# Altium schematic sheet Växelriktare.SchDoc
size A2; SheetNumber: 1; SheetTotal: 1
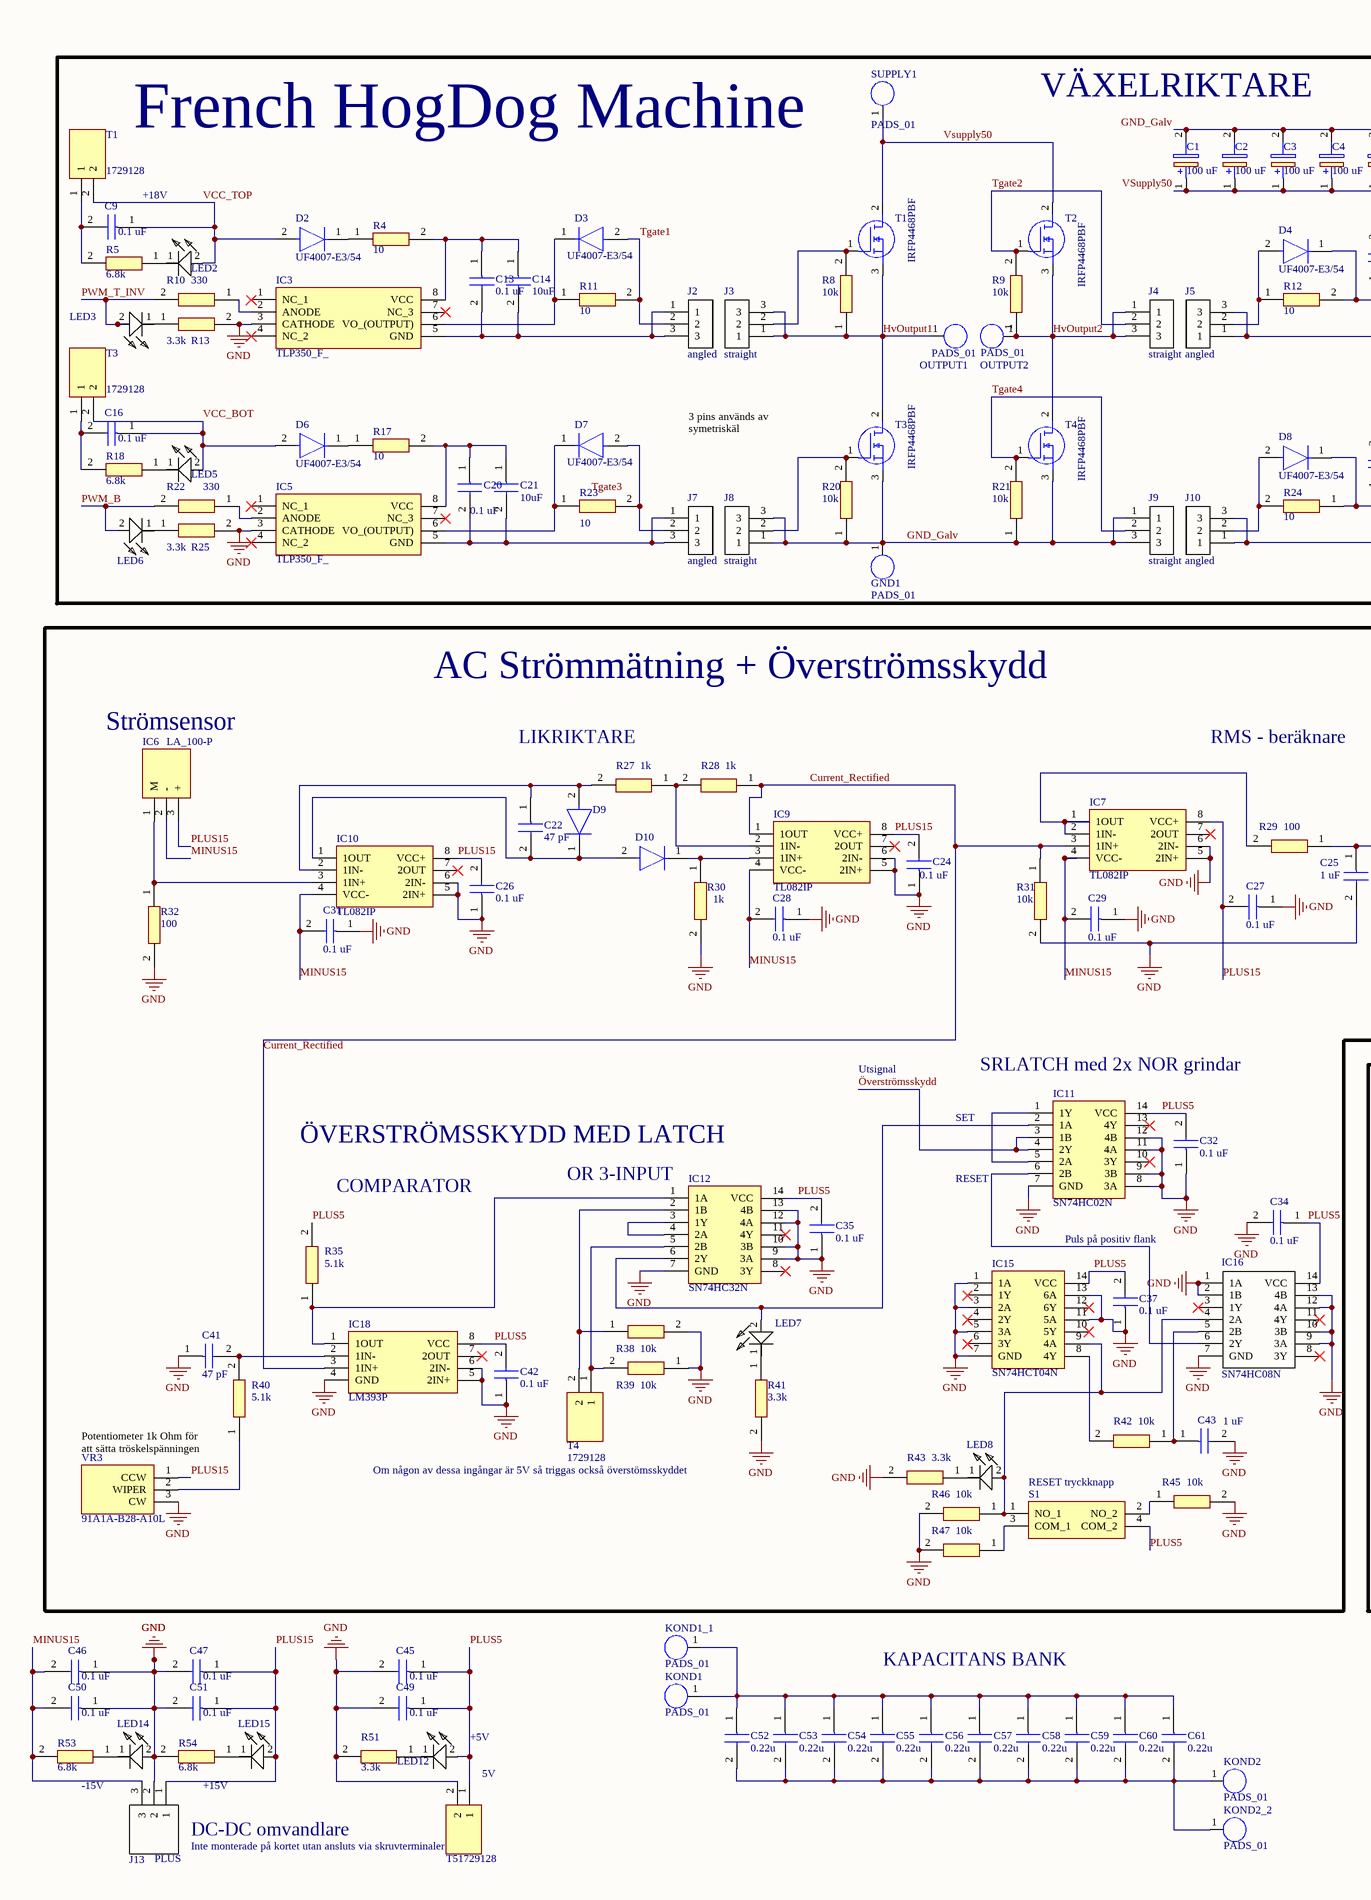
[diagram p0: Växelriktare.SchDoc, left]
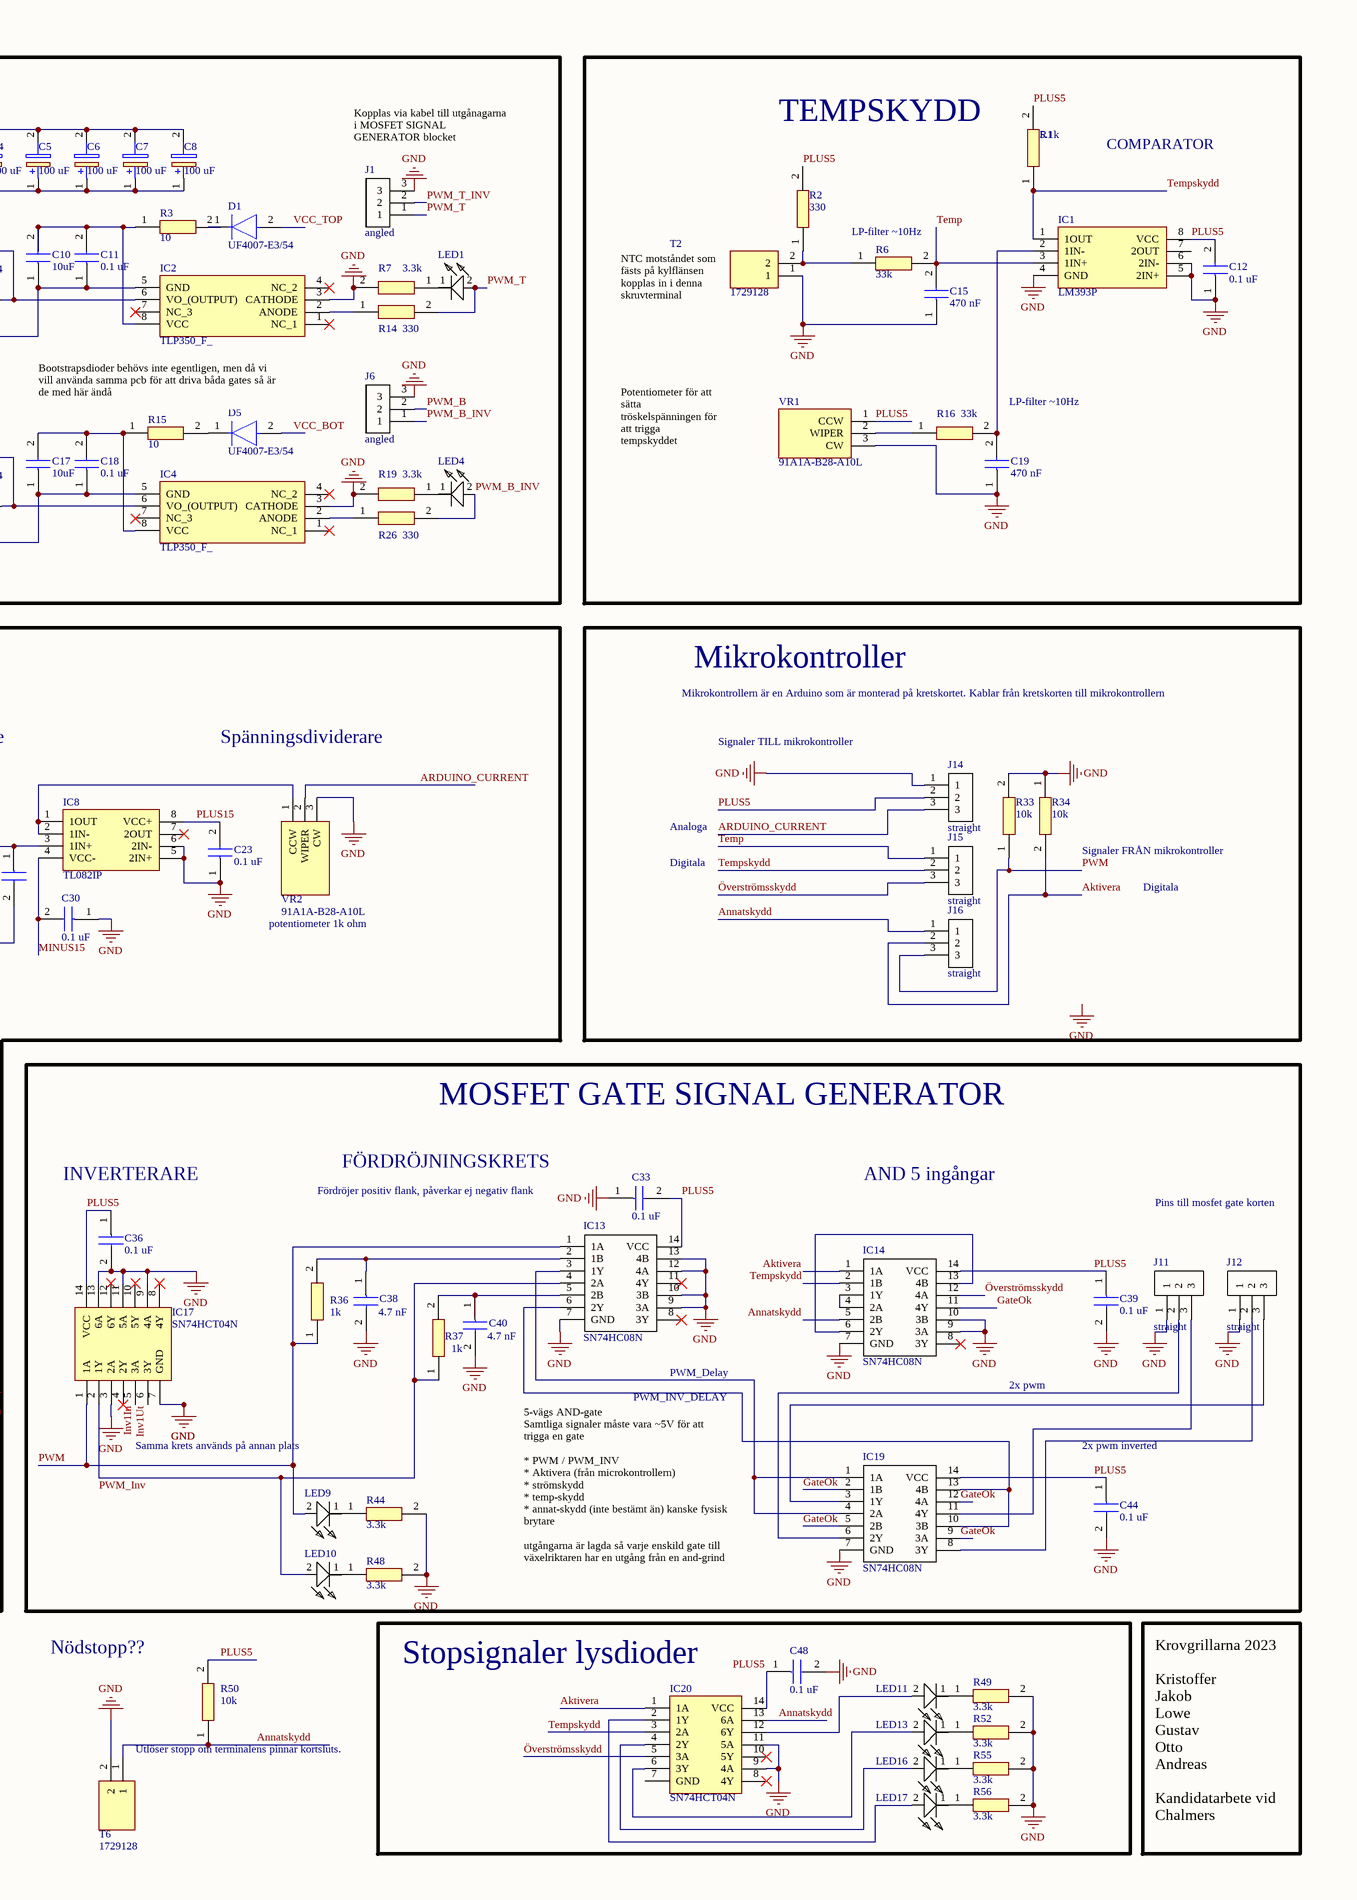
[diagram p1: Växelriktare.SchDoc, right]

## Parts
(Parts that share a designator on the sheet are numbered #1, #2 ... from top to bottom, then left to right.)
C1  100 uF  [CAPPRD500W65D1000H1300]
C2  100 uF  [CAPPRD500W65D1000H1300]
C3  100 uF  [CAPPRD500W65D1000H1300]
C4  100 uF  [CAPPRD500W65D1000H1300]
C5  100 uF  [CAPPRD500W65D1000H1300]
C6  100 uF  [CAPPRD500W65D1000H1300]
C7  100 uF  [CAPPRD500W65D1000H1300]
C8  100 uF  [CAPPRD500W65D1000H1300]
C9  0.1 uF  [R82(7.2X2.5)]
C10  10uF  [1814768]
C11  0.1 uF  [R82(7.2X2.5)]
C12  0.1 uF  [R82(7.2X2.5)]
C13  0.1 uF  [R82(7.2X2.5)]
C14  10uF  [1814768]
C15  470 nF  [C320C334K5R5TA91707301]
C16  0.1 uF  [R82(7.2X2.5)]
C17  10uF  [1814768]
C18  0.1 uF  [R82(7.2X2.5)]
C19  470 nF  [C320C334K5R5TA91707301]
C20  0.1 uF  [R82(7.2X2.5)]
C21  10uF  [1814768]
C22  47 pF  [DE11XRA470KA4BQ01F]
C23  0.1 uF  [R82(7.2X2.5)]
C24  0.1 uF  [R82(7.2X2.5)]
C25  1 uF  [C320C334K5R5TA91707301]
C26  0.1 uF  [R82(7.2X2.5)]
C27  0.1 uF  [R82(7.2X2.5)]
C28  0.1 uF  [R82(7.2X2.5)]
C29  0.1 uF  [R82(7.2X2.5)]
C30  0.1 uF  [R82(7.2X2.5)]
C31  0.1 uF  [R82(7.2X2.5)]
C32  0.1 uF  [R82(7.2X2.5)]
C33  0.1 uF  [R82(7.2X2.5)]
C34  0.1 uF  [R82(7.2X2.5)]
C35  0.1 uF  [R82(7.2X2.5)]
C36  0.1 uF  [R82(7.2X2.5)]
C37  0.1 uF  [R82(7.2X2.5)]
C38  4.7 nF  [C320C334K5R5TA91707301]
C39  0.1 uF  [R82(7.2X2.5)]
C40  4.7 nF  [C320C334K5R5TA91707301]
C41  47 pF  [DE11XRA470KA4BQ01F]
C42  0.1 uF  [R82(7.2X2.5)]
C43  1 uF  [C320C334K5R5TA91707301]
C44  0.1 uF  [R82(7.2X2.5)]
C45  0.1 uF  [R82(7.2X2.5)]
C46  0.1 uF  [R82(7.2X2.5)]
C47  0.1 uF  [R82(7.2X2.5)]
C48  0.1 uF  [R82(7.2X2.5)]
C49  0.1 uF  [R82(7.2X2.5)]
C50  0.1 uF  [R82(7.2X2.5)]
C51  0.1 uF  [R82(7.2X2.5)]
C52  0.22u  [PHE845VY6220MR30L2]
C53  0.22u  [PHE845VY6220MR30L2]
C54  0.22u  [PHE845VY6220MR30L2]
C55  0.22u  [PHE845VY6220MR30L2]
C56  0.22u  [PHE845VY6220MR30L2]
C57  0.22u  [PHE845VY6220MR30L2]
C58  0.22u  [PHE845VY6220MR30L2]
C59  0.22u  [PHE845VY6220MR30L2]
C60  0.22u  [PHE845VY6220MR30L2]
C61  0.22u  [PHE845VY6220MR30L2]
D1  UF4007-E3/54  [FP-UF4007-MFG]
D2  UF4007-E3/54  [FP-UF4007-MFG]
D3  UF4007-E3/54  [FP-UF4007-MFG]
D4  UF4007-E3/54  [FP-UF4007-MFG]
D5  UF4007-E3/54  [FP-UF4007-MFG]
D6  UF4007-E3/54  [FP-UF4007-MFG]
D7  UF4007-E3/54  [FP-UF4007-MFG]
D8  UF4007-E3/54  [FP-UF4007-MFG]
D9  UF4007-E3/54  [FP-UF4007-MFG]  (value not drawn)
D10  UF4007-E3/54  [FP-UF4007-MFG]  (value not drawn)
GND1  PADS_01  [PCBComponent_1]
IC1  LM393P  [DIP794W53P254L959H508Q8N]
IC2  TLP350_F_  [DIP762W60P254L966H485Q8N]
IC3  TLP350_F_  [DIP762W60P254L966H485Q8N]
IC4  TLP350_F_  [DIP762W60P254L966H485Q8N]
IC5  TLP350_F_  [DIP762W60P254L966H485Q8N]
IC6  LA_100-P  [LA-100-P]
IC7  TL082IP  [DIP794W53P254L959H508Q8N]
IC8  TL082IP  [DIP794W53P254L959H508Q8N]
IC9  TL082IP  [DIP794W53P254L959H508Q8N]
IC10  TL082IP  [DIP794W53P254L959H508Q8N]
IC11  SN74HC02N  [DIP794W53P254L1930H508Q14N]
IC12  SN74HC32N  [DIP794W53P254L1930H508Q14N]
IC13  SN74HC08N  [DIP794W53P254L1930H508Q14N]
IC14  SN74HC08N  [DIP794W53P254L1930H508Q14N]
IC15  SN74HCT04N  [DIP794W53P254L1930H508Q14N]
IC16  SN74HC08N  [DIP794W53P254L1930H508Q14N]
IC17  SN74HCT04N  [DIP794W53P254L1930H508Q14N]
IC18  LM393P  [DIP794W53P254L959H508Q8N]
IC19  SN74HC08N  [DIP794W53P254L1930H508Q14N]
IC20  SN74HCT04N  [DIP794W53P254L1930H508Q14N]
J1  angled  [RHDRRA3W79P254_1X3_813X851X241P]
J2  angled  [RHDRRA3W79P254_1X3_813X851X241P]
J3  straight  [HDRV3W67P0X254_1X3_737X236X1117P]
J4  straight  [HDRV3W67P0X254_1X3_737X236X1117P]
J5  angled  [RHDRRA3W79P254_1X3_813X851X241P]
J6  angled  [RHDRRA3W79P254_1X3_813X851X241P]
J7  angled  [RHDRRA3W79P254_1X3_813X851X241P]
J8  straight  [HDRV3W67P0X254_1X3_737X236X1117P]
J9  straight  [HDRV3W67P0X254_1X3_737X236X1117P]
J10  angled  [RHDRRA3W79P254_1X3_813X851X241P]
J11  straight  [HDRV3W67P0X254_1X3_737X236X1117P]
J12  straight  [HDRV3W67P0X254_1X3_737X236X1117P]
J13  PLUS  [1711039]
J14  straight  [HDRV3W67P0X254_1X3_737X236X1117P]
J15  straight  [HDRV3W67P0X254_1X3_737X236X1117P]
J16  straight  [HDRV3W67P0X254_1X3_737X236X1117P]
KOND1  PADS_01  [PCBComponent_1]
KOND1_1  PADS_01  [PCBComponent_1]
KOND2  PADS_01  [PCBComponent_1]
KOND2_2  PADS_01  [PCBComponent_1]
LED1  150141RS73113  [LEDM3528X210N]  (value not drawn)
LED2  150141RS73113  [LEDM3528X210N]  (value not drawn)
LED3  150141RS73113  [LEDM3528X210N]  (value not drawn)
LED4  150141RS73113  [LEDM3528X210N]  (value not drawn)
LED5  150141RS73113  [LEDM3528X210N]  (value not drawn)
LED6  150141RS73113  [LEDM3528X210N]  (value not drawn)
LED7  150141RS73113  [LEDM3528X210N]  (value not drawn)
LED8  150141RS73113  [LEDM3528X210N]  (value not drawn)
LED9  150141RS73113  [LEDM3528X210N]  (value not drawn)
LED10  150141RS73113  [LEDM3528X210N]  (value not drawn)
LED11  150141RS73113  [LEDM3528X210N]  (value not drawn)
LED12  150141RS73113  [LEDM3528X210N]  (value not drawn)
LED13  150141RS73113  [LEDM3528X210N]  (value not drawn)
LED14  150141RS73113  [LEDM3528X210N]  (value not drawn)
LED15  150141RS73113  [LEDM3528X210N]  (value not drawn)
LED16  150141RS73113  [LEDM3528X210N]  (value not drawn)
LED17  150141RS73113  [LEDM3528X210N]  (value not drawn)
OUTPUT1  PADS_01  [PCBComponent_1]
OUTPUT2  PADS_01  [PCBComponent_1]
R1  5.1k  [RESAD2760W83L1200D390]
R2  330  [RESAD2760W83L1200D390]
R3  10  [RESAD2760W83L1200D390]
R4  10  [RESAD2760W83L1200D390]
R5  6.8k  [RESAD2760W83L1200D390]
R6  33k  [RESAD2760W83L1200D390]
R7  3.3k  [RESAD2760W83L1200D390]
R8  10k  [RESAD2760W83L1200D390]
R9  10k  [RESAD2760W83L1200D390]
R10  330  [RESAD2760W83L1200D390]
R11  10  [RESAD2760W83L1200D390]
R12  10  [RESAD2760W83L1200D390]
R13  3.3k  [RESAD2760W83L1200D390]
R14  330  [RESAD2760W83L1200D390]
R15  10  [RESAD2760W83L1200D390]
R16  33k  [RESAD2760W83L1200D390]
R17  10  [RESAD2760W83L1200D390]
R18  6.8k  [RESAD2760W83L1200D390]
R19  3.3k  [RESAD2760W83L1200D390]
R20  10k  [RESAD2760W83L1200D390]
R21  10k  [RESAD2760W83L1200D390]
R22  330  [RESAD2760W83L1200D390]
R23  10  [RESAD2760W83L1200D390]
R24  10  [RESAD2760W83L1200D390]
R25  3.3k  [RESAD2760W83L1200D390]
R26  330  [RESAD2760W83L1200D390]
R27  1k  [RESAD2760W83L1200D390]
R28  1k  [RESAD2760W83L1200D390]
R29  100  [RESAD2760W83L1200D390]
R30  1k  [RESAD2760W83L1200D390]
R31  10k  [RESAD2760W83L1200D390]
R32  100  [RESAD2760W83L1200D390]
R33  10k  [RESAD2760W83L1200D390]
R34  10k  [RESAD2760W83L1200D390]
R35  5.1k  [RESAD2760W83L1200D390]
R36  1k  [RESAD2760W83L1200D390]
R37  1k  [RESAD2760W83L1200D390]
R38  10k  [RESAD2760W83L1200D390]
R39  10k  [RESAD2760W83L1200D390]
R40  5.1k  [RESAD2760W83L1200D390]
R41  3.3k  [RESAD2760W83L1200D390]
R42  10k  [RESAD2760W83L1200D390]
R43  3.3k  [RESAD2760W83L1200D390]
R44  3.3k  [RESAD2760W83L1200D390]
R45  10k  [RESAD2760W83L1200D390]
R46  10k  [RESAD2760W83L1200D390]
R47  10k  [RESAD2760W83L1200D390]
R48  3.3k  [RESAD2760W83L1200D390]
R49  3.3k  [RESAD2760W83L1200D390]
R50  10k  [RESAD2760W83L1200D390]
R51  3.3k  [RESAD2760W83L1200D390]
R52  3.3k  [RESAD2760W83L1200D390]
R53  6.8k  [RESAD2760W83L1200D390]
R54  6.8k  [RESAD2760W83L1200D390]
R55  3.3k  [RESAD2760W83L1200D390]
R56  3.3k  [RESAD2760W83L1200D390]
S1  PTS645SM43-2_LFS  [PTS645SM432LFS]  (value not drawn)
SUPPLY1  PADS_01  [PCBComponent_1]
T1#1  1729128  [1729128]
T1#2  IRFP4468PBF  [TO546P531X1558X2499-3P]
T2#1  IRFP4468PBF  [TO546P531X1558X2499-3P]
T2#2  1729128  [1729128]
T3#1  1729128  [1729128]
T3#2  IRFP4468PBF  [TO546P531X1558X2499-3P]
T4#1  IRFP4468PBF  [TO546P531X1558X2499-3P]
T4#2  1729128  [1729128]
T5  1729128  [1729128]
T6  1729128  [1729128]
VR1  91A1A-B28-A10L  [91A1AB28A10L]
VR2  91A1A-B28-A10L  [91A1AB28A10L]
VR3  91A1A-B28-A10L  [91A1AB28A10L]

## Blocks framed on the sheet
French HogDog Machine: C1-C11 C13 C14 C16-C18 C20 C21 D1-D8 GND1 IC2-IC5 J1-J10 LED1-LED6 OUTPUT1 OUTPUT2 R3-R5 R7-R15 R17-R26 SUPPLY1 T1#1 T1#2 T2#1 T3#1 T3#2 T4#1
TEMPSKYDD: C12 C15 C19 IC1 R1 R2 R6 R16 T2#2 VR1
AC Strömmätning + Överströmsskydd: C22-C32 C34 C35 C37 C41-C43 D9 D10 IC6-IC12 IC15 IC16 IC18 LED7 LED8 R27-R32 R35 R38-R43 R45-R47 S1 T4#2 VR2 VR3
Mikrokontroller: J14-J16 R33 R34
MOSFET GATE SIGNAL GENERATOR: C33 C36 C38-C40 C44 IC13 IC14 IC17 IC19 J11 J12 LED9 LED10 R36 R37 R44 R48
Stopsignaler lysdioder: C48 IC20 LED11 LED13 LED16 LED17 R49 R52 R55 R56

## Nets
GND: C12.1 C15.1 C19.1 C23.1 C24.1 C25.2 C26.1 C27.1 C28.1 C29.1 C30.1 C31.1 C32.1 C33.1 C34.2 C35.1 C36.2 C37.1 C38.2 C39.2 C40.2 C41.1 C42.1 C43.2 C44.2 C45.2 C46.1 C47.2 C48.2 C49.2 C50.1 C51.2 IC1.4(GND) IC1.5(2IN+) IC1.6(2IN-) IC2.3(CATHODE) IC3.3(CATHODE) IC4.3(CATHODE) IC5.3(CATHODE) IC7.5(2IN+) IC7.6(2IN-) IC8.5(2IN+) IC8.6(2IN-) IC9.5(2IN+) IC9.6(2IN-) IC10.5(2IN+) IC10.6(2IN-) IC11.7(GND) IC11.8(3A) IC11.9(3B) IC11.11(4A) IC11.12(4B) IC12.7(GND) IC12.9(3A) IC12.10(3B) IC12.12(4A) IC12.13(4B) IC13.7(GND) IC13.9(3A) IC13.10(3B) IC13.12(4A) IC13.13(4B) IC14.7(GND) IC14.9(3A) IC14.10(3B) IC15.1(1A) IC15.3(2A) IC15.5(3A) IC15.7(GND) IC15.11(5A) IC15.13(6A) IC16.1(1A) IC16.2(1B) IC16.7(GND) IC16.9(3A) IC16.10(3B) IC16.12(4A) IC16.13(4B) IC17.3(2A) IC17.7(GND) IC17.9(4A) IC17.11(5A) IC17.13(6A) IC18.4(GND) IC18.5(2IN+) IC18.6(2IN-) IC19.7(GND) IC20.9(4A) IC20.11(5A) J1.3 J6.3 J11.1 J12.1 J13.2 J14.1 LED14.2(A) R7.2 R13.2 R19.2 R25.2 R30.2 R31.2 R32.2 R33.2 R34.1 R38.2 R39.1 R41.2 R43.2 R44.2 R45.2 R46.2 R47.2 R48.2 R49.2 R51.2 R52.2 R54.2 R55.2 R56.2 T2#2.1 T5.2 T6.2 VR1.3(CW) VR2.3(CW) VR3.3(CW)
Aktivera: IC14.1(1A) IC20.1(1A) J16.2 R34.2
Annatskydd: IC14.5(2B) IC20.13(6A) J16.1 R50.1 T6.1
ARDUINO_CURRENT: J14.3 VR2.2(WIPER)
Current_Rectified: IC7.3(1IN+) IC9.1(1OUT) IC18.3(1IN+) R28.1 R31.1
GateOk: IC14.11(4Y) IC19.2(1B) IC19.5(2B) IC19.9(3A) IC19.12(4A)
GND_Galv: C1.2(-) C2.2(-) C3.2(-) C4.2(-) C5.2(-) C6.2(-) C7.2(-) C8.2(-) GND1.1 J8.1 J8.3 J9.1 J9.3 R20.1 R21.1 T3#2.3(S) T4#1.3(S)
HvOutput1: J3.1 J3.3 OUTPUT1.1 R8.1 T1#2.3(S) T3#2.2(D)
HvOutput2: J4.1 J4.3 OUTPUT2.1 R9.1 T2#1.3(S) T4#1.2(D)
Inv1In: IC17.5(3A)
Inv1Ut: IC17.6(3Y)
MINUS15: C28.2 C29.2 C30.2 C31.2 C46.2 C50.2 IC6.2(-) IC7.4(VCC-) IC8.4(VCC-) IC9.4(VCC-) IC10.4(VCC-) J13.3 R53.2
PLUS5: C12.2 C32.2 C33.2 C34.1 C35.2 C36.1 C37.2 C39.1 C42.2 C44.1 C45.1 C48.1 C49.1 IC1.8(VCC) IC11.14(VCC) IC12.14(VCC) IC13.14(VCC) IC14.14(VCC) IC15.14(VCC) IC16.14(VCC) IC17.14(VCC) IC18.8(VCC) IC19.14(VCC) IC20.14(VCC) J14.2 LED12.2(A) R1.2 R2.2 R35.2 R50.2 S1.4(COM_2) T5.1 VR1.1(CCW)
PLUS15: C23.2 C24.2 C26.2 C27.2 C47.1 C51.1 IC6.3(+) IC7.8(VCC+) IC8.8(VCC+) IC9.8(VCC+) IC10.8(VCC+) J13.1 LED15.2(A) VR3.1(CCW)
PWM: IC13.1(1A) IC17.1(1A) J16.3 LED9.2(A) R33.1 R36.1
PWM_B: J6.2 LED6.2(A) R22.2
PWM_B_INV: J6.1 LED4.2(A) R26.2
PWM_Inv: IC13.4(2A) IC17.2(1Y) LED10.2(A) R37.1
PWM_T: J1.1 LED1.2(A) R14.2
PWM_T_INV: J1.2 LED3.2(A) R10.2
Temp: C15.2 IC1.3(1IN+) J15.1 R6.2
Tempskydd: IC1.1(1OUT) IC14.2(1B) IC20.3(2A) J15.2 R1.1
Tgate1: D3.2(A) J2.2 R11.2
Tgate2: J4.2 R9.2 T2#1.1(G)
Tgate4: J9.2 R21.2 T4#1.1(G)
VCC_BOT: C16.1 D5.2(A) D6.2(A) LED5.2(A) T3#1.2
VCC_TOP: C9.1 D1.2(A) D2.2(A) LED2.2(A) T1#1.2
Vsupply50: C1.1(+) C2.1(+) C3.1(+) C4.1(+) C5.1(+) C6.1(+) C7.1(+) C8.1(+) SUPPLY1.1 T1#2.2(D) T2#1.2(D)
Överströmsskydd: IC11.3(1B) IC11.4(2Y) IC14.12(4A) IC20.5(3A) J15.3
NetC9_2: C9.2 R5.2 T1#1.1
NetC10_1: C10.1(+) C11.1 IC2.5(GND) J5.1 J5.3
NetC10_2: C10.2(-) C11.2 IC2.8(VCC) R3.1
NetC13_1: C13.1 C14.1(+) IC3.8(VCC) R4.2
NetC13_2: C13.2 C14.2(-) IC3.5(GND) J2.1 J2.3
NetC16_2: C16.2 R18.2 T3#1.1
NetC17_1: C17.1(+) C18.1 IC4.5(GND) J10.1 J10.3
NetC17_2: C17.2(-) C18.2 IC4.8(VCC) R15.1
NetC19_2: C19.2 IC1.2(1IN-) R16.2
NetC20_1: C20.1 C21.1(+) IC5.8(VCC) R17.2
NetC20_2: C20.2 C21.2(-) IC5.5(GND) J7.1 J7.3
NetC22_1: C22.1 D9.2(A) IC10.2(1IN-) R27.2
NetC22_2: C22.2 D9.1(C) D10.2(A) IC10.1(1OUT)
NetC25_1: C25.1 IC8.3(1IN+) R29.1
NetC38_1: C38.1 IC13.2(1B) R36.2
NetC40_1: C40.1 IC13.5(2B) R37.2
NetC41_2: C41.2 IC18.2(1IN-) R40.2
NetC43_1: C43.1 IC16.5(2B) R42.1
NetC52_1: C52.1 C53.1 C54.1 C55.1 C56.1 C57.1 C58.1 C59.1 C60.1 C61.1 KOND1.1 KOND1_1.1
NetC52_2: C52.2 C53.2 C54.2 C55.2 C56.2 C57.2 C58.2 C59.2 C60.2 C61.2 KOND2.1 KOND2_2.1
NetD1_1: D1.1(C) R3.2
NetD2_1: D2.1(C) R4.1
NetD3_1: D3.1(C) IC3.6(VO_(OUTPUT)) R11.1
NetD4_1: D4.1(C) IC2.6(VO_(OUTPUT)) R12.2
NetD4_2: D4.2(A) J5.2 R12.1
NetD5_1: D5.1(C) R15.2
NetD6_1: D6.1(C) R17.1
NetD7_1: D7.1(C) IC5.6(VO_(OUTPUT)) R23.1
NetD7_2: D7.2(A) J7.2 R23.2
NetD8_1: D8.1(C) IC4.6(VO_(OUTPUT)) R24.1
NetD8_2: D8.2(A) J10.2 R24.2
NetD10_1: D10.1(C) IC9.3(1IN+) R30.1
NetIC2_2: IC2.2(ANODE) R14.1
NetIC3_2: IC3.2(ANODE) R10.1
NetIC4_2: IC4.2(ANODE) R26.1
NetIC5_2: IC5.2(ANODE) R22.1
NetIC6_1: IC6.1(M) IC10.3(1IN+) R32.1
NetIC7_1: IC7.1(1OUT) IC7.2(1IN-) R29.2
NetIC8_1: IC8.1(1OUT) IC8.2(1IN-) VR2.1(CCW)
NetIC9_2: IC9.2(1IN-) R27.1 R28.2
NetIC11_1: IC11.1(1Y) IC11.5(2A)
NetIC11_2: IC11.2(1A) IC12.6(2Y) LED7.2(A)
NetIC11_6: IC11.6(2B) IC16.6(2Y)
NetIC12_1: IC12.1(1A) IC18.1(1OUT) R35.1
NetIC12_2: IC12.2(1B) R38.1 T4#2.2
NetIC12_3: IC12.3(1Y) IC12.4(2A)
NetIC12_5: IC12.5(2B) R39.2 T4#2.1
NetIC13_3: IC13.3(1Y) IC19.1(1A) IC19.4(2A)
NetIC13_6: IC13.6(2Y) IC19.10(3B) IC19.13(4B)
NetIC14_3: IC14.3(1Y) IC14.4(2A)
NetIC14_6: IC14.6(2Y) IC14.13(4B)
NetIC15_8: IC15.8(4Y) R42.2
NetIC15_9: IC15.9(4A) IC16.4(2A) LED8.2(A) R46.1 S1.1(NO_1)
NetIC19_3: IC19.3(1Y) J12.3
NetIC19_6: IC19.6(2Y) J11.2
NetIC19_8: IC19.8(3Y) J12.2
NetIC19_11: IC19.11(4Y) J11.3
NetIC20_2: IC20.2(1Y) LED17.2(A)
NetIC20_4: IC20.4(2Y) LED16.2(A)
NetIC20_6: IC20.6(3Y) LED13.2(A)
NetIC20_12: IC20.12(6Y) LED11.2(A)
NetJ3_2: J3.2 R8.2 T1#2.1(G)
NetJ8_2: J8.2 R20.2 T3#2.1(G)
NetLED1_1: LED1.1(K) R7.1
NetLED2_1: LED2.1(K) R5.1
NetLED3_1: LED3.1(K) R13.1
NetLED4_1: LED4.1(K) R19.1
NetLED5_1: LED5.1(K) R18.1
NetLED6_1: LED6.1(K) R25.1
NetLED7_1: LED7.1(K) R41.1
NetLED8_1: LED8.1(K) R43.1
NetLED9_1: LED9.1(K) R44.1
NetLED10_1: LED10.1(K) R48.1
NetLED11_1: LED11.1(K) R49.1
NetLED12_1: LED12.1(K) R51.1
NetLED13_1: LED13.1(K) R52.1
NetLED14_1: LED14.1(K) R53.1
NetLED15_1: LED15.1(K) R54.1
NetLED16_1: LED16.1(K) R55.1
NetLED17_1: LED17.1(K) R56.1
NetR2_1: R2.1 R6.1 T2#2.2
NetR16_1: R16.1 VR1.2(WIPER)
NetR40_1: R40.1 VR3.2(WIPER)
NetR45_1: R45.1 S1.2(NO_2)
NetR47_1: R47.1 S1.3(COM_1)

Not connected (* = marked no-connect by the designer): IC1 7(2OUT); IC2 1(NC_1)* 4(NC_2)* 7(NC_3)*; IC3 1(NC_1)* 4(NC_2)* 7(NC_3)*; IC4 1(NC_1)* 4(NC_2)* 7(NC_3)*; IC5 1(NC_1)* 4(NC_2)* 7(NC_3)*; IC7 7(2OUT)*; IC8 7(2OUT)*; IC9 7(2OUT)*; IC10 7(2OUT)*; IC11 10(3Y)* 13(4Y)*; IC12 8(3Y)* 11(4Y)*; IC13 8(3Y)* 11(4Y)*; IC14 8(3Y)*; IC15 2(1Y)* 4(2Y)* 6(3Y)* 10(5Y)* 12(6Y)*; IC16 3(1Y)* 8(3Y)* 11(4Y)*; IC17 4(2Y)* 8(4Y)* 10(5Y)* 12(6Y)*; IC18 7(2OUT)*; IC20 7(GND) 8(4Y)* 10(5Y)*

## Notes on the sheet
- VÄXELRIKTARE
- Kopplas via kabel till utgånagarna i MOSFET SIGNAL GENERATOR blocket
- COMPARATOR
- +18V
- (near R6) LP-filter ~10Hz
- NTC motståndet som fästs på kylflänsen kopplas in i denna skruvterminal
- Bootstrapsdioder behövs inte egentligen, men då vi vill använda samma pcb för att driva båda gates så är de med här ändå
- LP-filter ~10Hz
- 3 pins används av symetriskäl
- Potentiometer för att sätta tröskelspänningen för att trigga tempskyddet
- Mikrokontrollern är en Arduino som är monterad på kretskortet. Kablar från kretskorten till mikrokontrollern
- Strömsensor
- (near R27) LIKRIKTARE
- RMS - beräknare
- Spänningsdividerare
- Signaler TILL mikrokontroller
- Analoga
- Digitala
- (near R34) Signaler FRÅN mikrokontroller
- potentiometer 1k ohm
- Utsignal
- (near IC11) SRLATCH med 2x NOR grindar
- SET
- ÖVERSTRÖMSSKYDD MED LATCH
- (near IC12) OR 3-INPUT
- RESET
- INVERTERARE
- Fördröjer positiv flank, påverkar ej negativ flank
- FÖRDRÖJNINGSKRETS
- AND 5 ingångar
- Puls på positiv flank
- Pins till mosfet gate korten
- PWM_Delay
- PWM_INV_DELAY
- 2x pwm
- Potentiometer 1k Ohm för att sätta tröskelspänningen
- Om någon av dessa ingångar är 5V så triggas också överstömsskyddet
- RESET tryckknapp
- Samma krets används på annan plats
- 2x pwm inverted
- 5-vägs AND-gate
  Samtliga signaler måste vara ~5V för att trigga en gate
  * PWM / PWM_INV
  * Aktivera (från microkontrollern)
  * strömskydd
  * temp-skydd
  * annat-skydd (inte bestämt än) kanske fysisk brytare
  utgångarna är lagda så varje enskild gate till växelriktaren har en utgång från en and-grind
- KAPACITANS BANK
- Nödstopp??
- (near LED12) +5V
- -15V
- +15V
- 5V
- Utlöser stopp om terminalens pinnar kortsluts.
- (near J13) DC-DC omvandlare
- Inte monterade på kortet utan ansluts via skruvterminaler
- Krovgrillarna 2023
  Kristoffer
  Jakob
  Lowe
  Gustav
  Otto
  Andreas
  Kandidatarbete vid Chalmers
- Labels drawn without touching a wire or pin: GND, Tgate3

## Library data of the parts
C1-C8 = 63SXE100M: Capacitor Polarised; Manufacturer_Name: Panasonic; Datasheet Link: http://industrial.panasonic.com/cdbs/www-data/pdf/AAB8000/AAB8000C262.pdf; Height: 13mm; Manufacturer_Part_Number: 63SXE100M; Mouser Part Number: 667-63SXE100M; Mouser Price/Stock: https://www.mouser.co.uk/ProductDetail/Panasonic/63SXE100M?qs=%252B6g0mu59x7Ltzd4977WBfg%3D%3D
C9 C11-C13 C15 C16 C18-C20 C23-C40 C42-C51 = C320C334K5R5TA91707301: Capacitor; Manufacturer_Name: KEMET; Datasheet Link: https://content.kemet.com/datasheets/KEM_C1053_GOLDMAX_X7R_AUTO.pdf; Manufacturer_Part_Number: C320C334K5R5TA91707301; Mouser Part Number: 80-C320C334K5R9170-R; Mouser Price/Stock: https://www.mouser.co.uk/ProductDetail/KEMET/C320C334K5R5TA91707301?qs=CMe0l2alOJWOav3f3bfBiQ%3D%3D
C10 C14 C17 C21 = 181-4768: Capacitor; Manufacturer_Name: RS Components; Datasheet Link: https://docs.rs-online.com/821c/0900766b816c111a.pdf; Height: 13mm; Manufacturer_Part_Number: 181-4768
C22 C41 = DE11XRA470KA4BQ01F: Capacitor; Manufacturer_Name: Murata Electronics; Datasheet Link: https://www.mouser.com/datasheet/2/281/DE1_RA_Q01F_E-1115434.pdf; Height: 11mm; Manufacturer_Part_Number: DE11XRA470KA4BQ01F; Mouser Part Number: 81-DE11XRA470KA4BQ1F; Mouser Price/Stock: https://www.mouser.co.uk/ProductDetail/Murata-Electronics/DE11XRA470KA4BQ01F?qs=5aG0NVq1C4zq%2FuZurxxCqg%3D%3D; Arrow Part Number: DE11XRA470KA4BQ01F; Arrow Price/Stock: https://www.arrow.com/en/products/de11xra470ka4bq01f/murata-manufacturing
C52-C61 = PHE845VY6220MR30L2: Capacitor; Manufacturer_Name: KEMET; Datasheet Link: https://connect.kemet.com:7667/gateway/IntelliData-ComponentDocumentation/1.0/download/specsheet/F845DY224M760ALW0L; Height: 24.5mm; Manufacturer_Part_Number: PHE845VY6220MR30L2; Mouser Part Number: 80-PHE845VY6220MR30; Mouser Price/Stock: https://www.mouser.co.uk/ProductDetail/KEMET/PHE845VY6220MR30L2?qs=MdJgNetHbfmnkWE77glUFA%3D%3D
D1-D10 = CMP-02540-000043-1: DIODE GEN PURP 1KV 1A DO204AL; Manufacturer: Vishay; Max Junction Temp: +150°C; Max Repetitive Reverse Voltage: 1000V; Max Surge Forward Current: 30A; Capacitance: 17pF; Peak Reverse Current: 10uA; Value: 17pF; Package: UF4007; Height: 2.7mm; RoHS: TRUE; Device Class L3: Rectifier Diodes; Temperature Range Low: -55°C; Ipc Land Pattern Name: DIOPA1088W105L520D270; Temperature: -55°C to +150°C; Category: Diode; Device Class L2: Diodes; Device Class L1: Discrete Semiconductors; Digikey Description: DIODE GEN PURP 1KV 1A DO204AL; Octopart: https://octopart.com/uf4007-e3%2F54-vishay-42333894; Mouser Description: Rectifiers Vr/1000V Io/1A; ComponentLink2URL: http://www.vishay.com/docs/88755/uf4001.pdf; Lead Free: Yes; Temperature Range High: +150°C; Automotive: No; Manufacturer Part Number: UF4007-E3/54; ComponentLink2Description: Datasheet; Forward Current: 1A
GND1 KOND1 KOND1_1 KOND2 KOND2_2 OUTPUT1 OUTPUT2 SUPPLY1 = PADS_01: Pads for bigger Coil and capacitors outside your circuit
IC1 IC18 = LM393P: Integrated Circuit; Manufacturer_Name: Texas Instruments; Datasheet Link: http://www.ti.com/lit/ds/symlink/lm393.pdf; Height: 5.08mm; Manufacturer_Part_Number: LM393P; Mouser Part Number: 595-LM393P; Mouser Price/Stock: https://www.mouser.co.uk/ProductDetail/Texas-Instruments/LM393P?qs=1K8%2FAQHn5WT5g4otW1rg%2Fg%3D%3D; Arrow Part Number: LM393P; Arrow Price/Stock: https://www.arrow.com/en/products/lm393p/texas-instruments?region=nac
IC2-IC5 = TLP350_F_: Integrated Circuit; Manufacturer_Name: Toshiba; Manufacturer_Part_Number: TLP350(F); Datasheet Link: https://toshiba.semicon-storage.com/info/docget.jsp?did=6217&prodName=TLP350; Height: 4.85mm; Mouser Part Number: 757-TLP350(F); Mouser Price/Stock: https://www.mouser.co.uk/ProductDetail/Toshiba/TLP350F?qs=f0GatGUIxV2gwSZ6twItgg%3D%3D
IC6 = LA_100-P: Current Sensor; Manufacturer_Name: LEM; Manufacturer_Part_Number: LA 100-P; Datasheet Link: https://datasheet.datasheetarchive.com/originals/distributors/Datasheets-16/DSA-314838.pdf
IC7-IC10 = TL082IP: Integrated Circuit; Manufacturer_Name: Texas Instruments; Datasheet Link: http://www.ti.com/lit/ds/symlink/tl081a.pdf; Height: 5.08mm; Manufacturer_Part_Number: TL082IP; Mouser Part Number: 595-TL082IP; Mouser Price/Stock: https://www.mouser.com/Search/Refine.aspx?Keyword=595-TL082IP; Arrow Part Number: TL082IP; Arrow Price/Stock: https://www.arrow.com/en/products/tl082ip/texas-instruments
IC11 = SN74HC02N: Integrated Circuit; Manufacturer_Name: Texas Instruments; Datasheet Link: https://datasheet.datasheetarchive.com/originals/distributors/SFDatasheet-6/sf-000133830.pdf; Height: 5.08mm; Manufacturer_Part_Number: SN74HC02N; Mouser Part Number: 595-SN74HC02N; Mouser Price/Stock: https://www.mouser.co.uk/ProductDetail/Texas-Instruments/SN74HC02N?qs=st7IWvlL5%2FjbIdufZ10xyA%3D%3D; Arrow Part Number: SN74HC02N; Arrow Price/Stock: https://www.arrow.com/en/products/sn74hc02n/texas-instruments?region=nac
IC12 = SN74HC32N: Integrated Circuit; Manufacturer_Name: Texas Instruments; Datasheet Link: http://www.ti.com/lit/gpn/sn74hc32; Height: 5.08mm; Manufacturer_Part_Number: SN74HC32N; Mouser Part Number: 595-SN74HC32N; Mouser Price/Stock: https://www.mouser.co.uk/ProductDetail/Texas-Instruments/SN74HC32N?qs=tJ5HNKWh3OWs99bm2e8RtQ%3D%3D; Arrow Part Number: SN74HC32N; Arrow Price/Stock: https://www.arrow.com/en/products/sn74hc32n/texas-instruments
IC13 IC14 IC16 IC19 = SN74HC08N: Integrated Circuit; Manufacturer_Name: Texas Instruments; Datasheet Link: http://componentsearchengine.com/Datasheets/1/SN74HC08N.pdf; Height: 5.08mm; Manufacturer_Part_Number: SN74HC08N; Mouser Part Number: 595-SN74HC08N; Mouser Price/Stock: https://www.mouser.co.uk/ProductDetail/Texas-Instruments/SN74HC08N?qs=UGVLDq%2F29uh3etwCLMoeTA%3D%3D; Arrow Part Number: SN74HC08N; Arrow Price/Stock: https://www.arrow.com/en/products/sn74hc08n/texas-instruments?region=nac
IC15 IC17 IC20 = SN74HCT04N: Integrated Circuit; Manufacturer_Name: Texas Instruments; Datasheet Link: http://www.ti.com/lit/gpn/sn74hct04; Height: 5.08mm; Manufacturer_Part_Number: SN74HCT04N; Mouser Part Number: 595-SN74HCT04N; Mouser Price/Stock: https://www.mouser.co.uk/ProductDetail/Texas-Instruments/SN74HCT04N?qs=dQtLEVC3WoYXjRsBQqZvgw%3D%3D; Arrow Part Number: SN74HCT04N; Arrow Price/Stock: https://www.arrow.com/en/products/sn74hct04n/texas-instruments?region=nac
J1 J2 J5-J7 J10 = SSW-103-02-G-S-RA-LL: Connector; Manufacturer_Name: SAMTEC; Datasheet Link: http://suddendocs.samtec.com/catalog_english/ssw_th.pdf; Height: 2.41mm; Manufacturer_Part_Number: SSW-103-02-G-S-RA-LL; Mouser Part Number: 200-SSW10302GSRALL; Mouser Price/Stock: https://www.mouser.co.uk/ProductDetail/Samtec/SSW-103-02-G-S-RA-LL?qs=lDMevKbHVyti%252BcbLX5U9iA%3D%3D
J3 J4 J8 J9 J11 J12 J14-J16 = 22-03-2031: Connector; Manufacturer_Name: Molex; Datasheet Link: http://www.molex.com/pdm_docs/sd/022032031_sd.pdf; Height: 11.17mm; Manufacturer_Part_Number: 22-03-2031; Mouser Part Number: 538-22-03-2031; Mouser Price/Stock: https://www.mouser.co.uk/ProductDetail/Molex/22-03-2031?qs=ILqg114nvd5V8pMNdVJtPA%3D%3D
J13 = 1711039: Connector; Manufacturer_Name: Phoenix Contact; Datasheet Link: http://www.phoenixcontact.com/de/produkte/1711039/pdf; Height: 18.2mm; Manufacturer_Part_Number: 1711039; Mouser Part Number: 651-1711039; Mouser Price/Stock: https://www.mouser.co.uk/ProductDetail/Phoenix-Contact/1711039?qs=YbgdthCBnKeEUIePCOJ5Kg%3D%3D; Arrow Part Number: 1711039; Arrow Price/Stock: https://www.arrow.com/en/products/1711039/phoenix-contact?region=nac
LED1-LED17 = 150141RS73113: LED; Manufacturer_Name: Wurth Elektronik; Datasheet Link: https://katalog.we-online.de/led/datasheet/150141RS73113.pdf; Height: 2.1mm; Manufacturer_Part_Number: 150141RS73113; Mouser Part Number: 710-150141RS73113; Mouser Price/Stock: https://www.mouser.co.uk/ProductDetail/Wurth-Elektronik/150141RS73113?qs=u16ybLDytRaJkUgH%252BpeDTw%3D%3D
R1-R56 = PR02000201009JR500: Resistor; Manufacturer_Name: Vishay; Datasheet Link: https://componentsearchengine.com/Datasheets/2/PR02000201009JR500.pdf; Manufacturer_Part_Number: PR02000201009JR500; Mouser Part Number: 594-5083NW10R00J; Mouser Price/Stock: https://www.mouser.co.uk/ProductDetail/Vishay-BC-Components/PR02000201009JR500?qs=7reVrgTiN3YqjE9KUsFQcQ%3D%3D; Arrow Part Number: PR02000201009JR500; Arrow Price/Stock: https://www.arrow.com/en/products/pr02000201009jr500/vishay?region=nac
S1 = PTS645SM43-2_LFS: Switch; Manufacturer_Name: C & K COMPONENTS; Manufacturer_Part_Number: PTS645SM43-2 LFS; Datasheet Link: https://www.tme.com/Document/8b519d7a65df20ea1a483c3db2ec3948/pts645-DTE.pdf; Height: 4.4mm; Mouser Part Number: 611-PTS645SM432; Mouser Price/Stock: https://www.mouser.com/Search/Refine.aspx?Keyword=611-PTS645SM432; Arrow Part Number: PTS645SM43-2 LFS; Arrow Price/Stock: https://www.arrow.com/en/products/pts645sm432lfs/ck?region=nac
T1#1 T2#2 T3#1 T4#2 T5 T6 = 1729128: Connector; Manufacturer_Name: Phoenix Contact; Datasheet Link: http://www.phoenixcontact.net/product/1729128; Height: 10.15mm; Manufacturer_Part_Number: 1729128; Mouser Part Number: 651-1729128; Mouser Price/Stock: https://www.mouser.co.uk/ProductDetail/Phoenix-Contact/1729128?qs=GFUSqQMLmmnCBVBY3dts9w%3D%3D; Arrow Part Number: 1729128; Arrow Price/Stock: https://www.arrow.com/en/products/1729128/phoenix-contact?region=nac
T1#2 T2#1 T3#2 T4#1 = IRFP4468PBF: MOSFET (N-Channel); Manufacturer_Name: Infineon; Datasheet Link: https://eagle.componentsearchengine.com/Datasheets/2/IRFP4468PBF.pdf; Height: 5.31mm; Manufacturer_Part_Number: IRFP4468PBF; Mouser Part Number: 942-IRFP4468PBF; Mouser Price/Stock: https://www.mouser.co.uk/ProductDetail/Infineon-Technologies/IRFP4468PBF?qs=9%252BKlkBgLFf2xb8HkRZHvkw%3D%3D; Arrow Part Number: IRFP4468PBF; Arrow Price/Stock: https://www.arrow.com/en/products/irfp4468pbf/infineon-technologies-ag?region=nac
VR1-VR3 = 91A1A-B28-A10L: Variable Resistor; Manufacturer_Name: Bourns; Datasheet Link: https://componentsearchengine.com/Datasheets/2/91A1A-B28-A10L.pdf; Height: 17.45mm; Manufacturer_Part_Number: 91A1A-B28-A10L; Mouser Part Number: 652-91A1A-B28-A10L; Mouser Price/Stock: https://www.mouser.co.uk/ProductDetail/Bourns/91A1A-B28-A10L?qs=1v0N1zrvLE7fztbDhYOM%252Bg%3D%3D; Arrow Part Number: 91A1A-B28-A10L; Arrow Price/Stock: https://www.arrow.com/en/products/91a1a-b28-a10l/bourns